# Altium schematic sheet GTM_SPIconnector.SchDoc
size A4
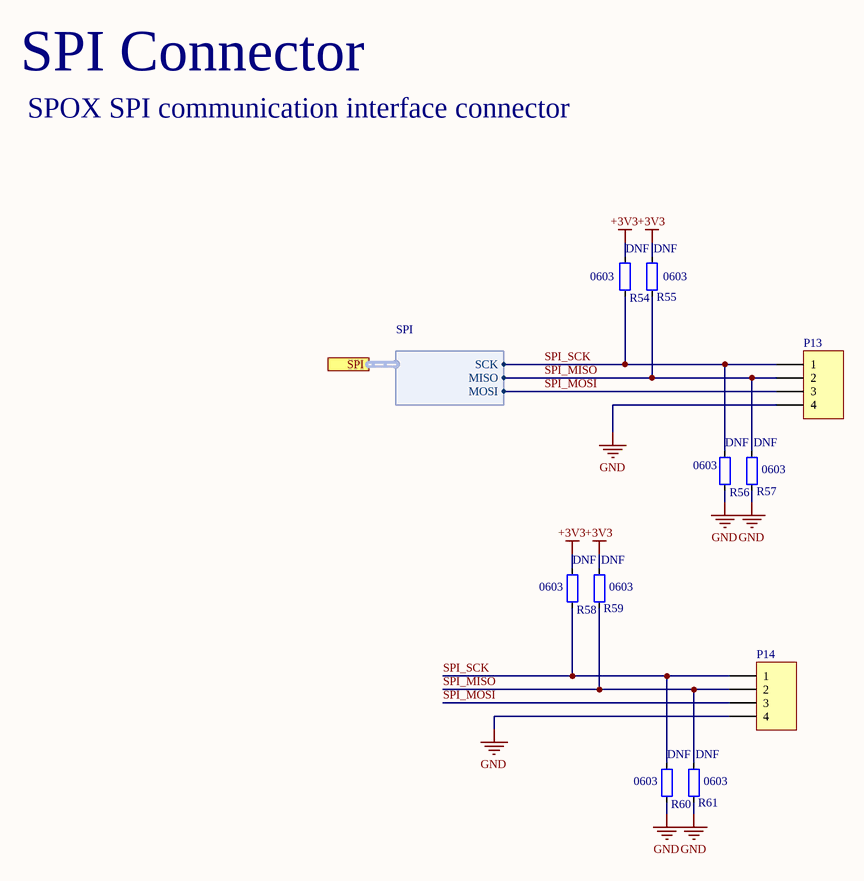
[diagram p0: GTM_SPIconnector.SchDoc]

## Parts
P13  HDR1X4  [Molex SPOX Angle 4 Circuits]  (value not drawn)
P14  HDR1X4  [Molex SPOX Angle 4 Circuits]  (value not drawn)
R54  DNF  [0603]
R55  DNF  [0603]
R56  DNF  [0603]
R57  DNF  [0603]
R58  DNF  [0603]
R59  DNF  [0603]
R60  DNF  [0603]
R61  DNF  [0603]

## Ports
SPI (harness SPI)

## Harnesses
SPI: SCK, MISO, MOSI

## Nets
+3V3: R54.2 R55.2 R58.2 R59.2
GND: P13.4 P14.4 R56.1 R57.1 R60.1 R61.1
SPI_MISO: P13.2 P14.2 R55.1 R57.2 R59.1 R61.2 ; port SPI.MISO
SPI_MOSI: P13.3 P14.3 ; port SPI.MOSI
SPI_SCK: P13.1 P14.1 R54.1 R56.2 R58.1 R60.2 ; port SPI.SCK

## Notes on the sheet
- SPI Connector
- SPOX SPI communication interface connector
- Project
- Rev.
- Title
- Drawn by
- Date
- Sheet
- of
- Checked by

## Library data of the parts
P13 = HDR1X4: Header, 4-Pin; LatestRevisionDate: 17-Jul-2002; LatestRevisionNote: Re-released for DXP Platform.; Publisher: Altium Limited
P14 = HDR1X4: Doubled SPI Connector; LatestRevisionDate: 17-Jul-2002; LatestRevisionNote: Re-released for DXP Platform.; Publisher: Altium Limited
R54-R61 = RES: Resistior; Value: DNF; Tolerance: *; Package: 0603